# Altium schematic sheet ProgrammingInterface.SchDoc
size A4
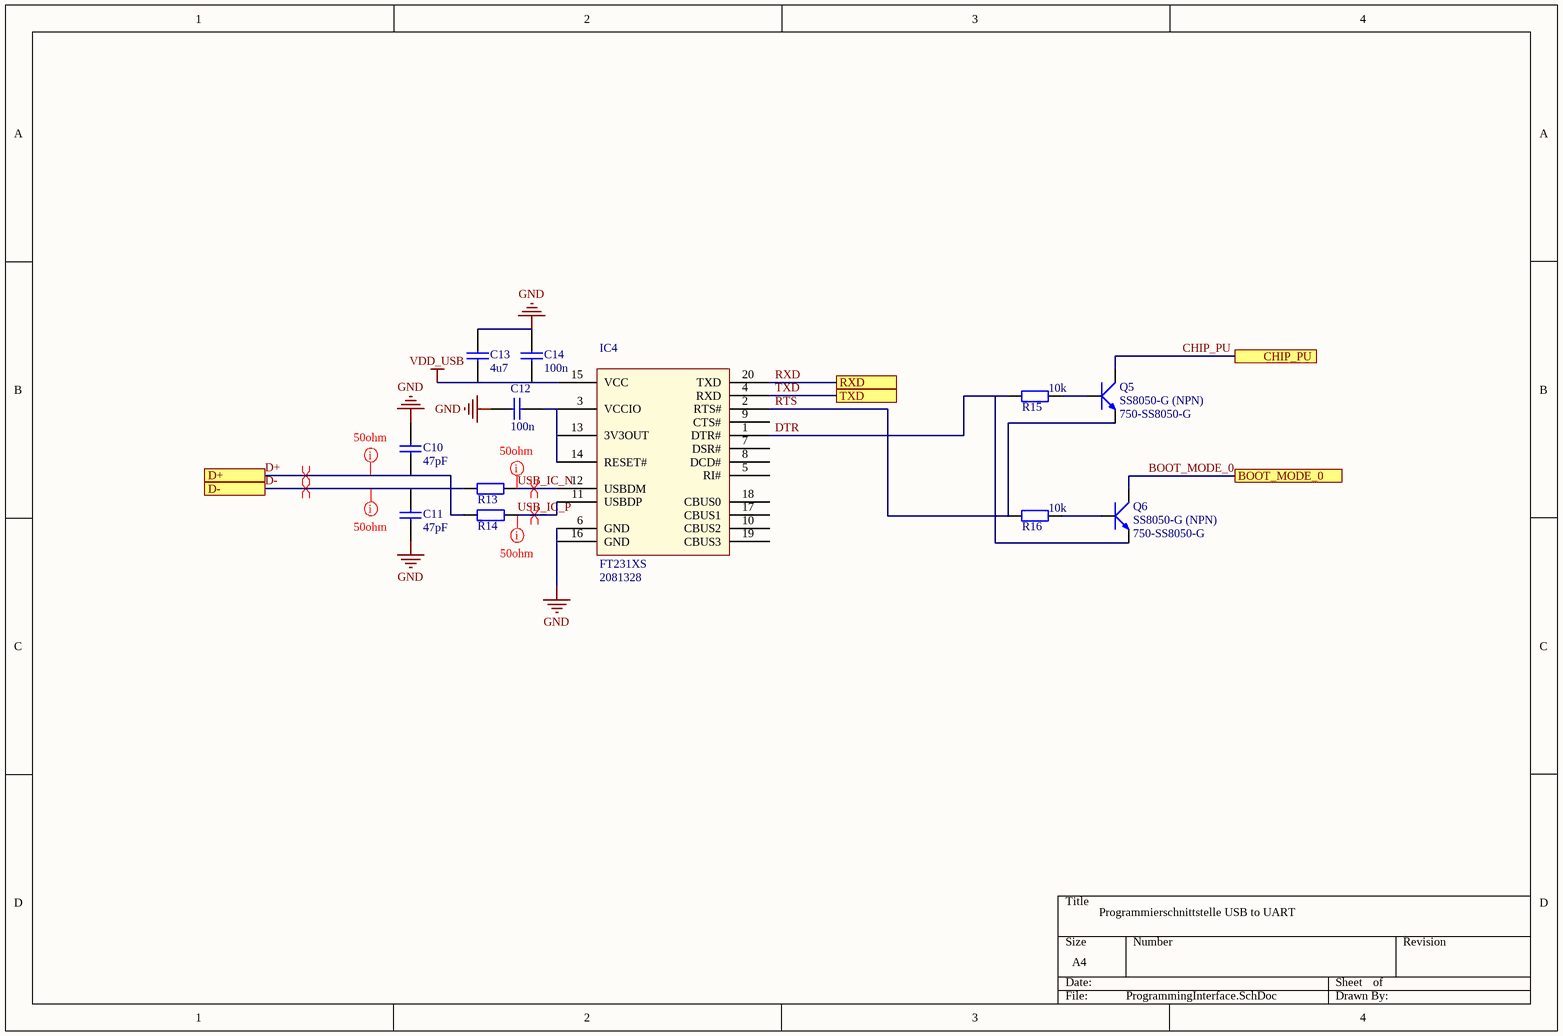
[diagram p0: ProgrammingInterface.SchDoc]

## Parts
C10  47pF  [CAPC1005X55]
C11  47pF  [CAPC1005X55]
C12  100n  [CAPC1005X55]
C13  4u7  [CAPC1005X55]
C14  100n  [CAPC1005X55]
IC4  FT231XS  Supplier Part Number 1: 2081328  [SOP65P600X175-20]
Q5  SS8050-G (NPN)  Supplier Part Number 1: 750-SS8050-G  [SS8050-G (NPN)]
Q6  SS8050-G (NPN)  Supplier Part Number 1: 750-SS8050-G  [SS8050-G (NPN)]
R13  (no value)  [RESC1005X40]
R14  (no value)  [RESC1005X40]
R15  10k  [RESC1005X40]
R16  10k  [RESC1005X40]

## Ports
BOOT_MODE_0, CHIP_PU, D+, D-, RXD, TXD

## Nets
GND: C10.2 C11.1 C12.1 C13.2 C14.2 IC4.6(GND) IC4.16(GND)
VDD_USB: C13.1 C14.1 IC4.15(VCC)
BOOT_MODE_0: Q6.3(Collector) ; port BOOT_MODE_0
CHIP_PU: Q5.3(Collector) ; port CHIP_PU
D+: C10.1 R14.1 ; port D+
D-: C11.2 R13.1 ; port D-
DTR: IC4.1(DTR#) Q6.2(Emitter) R15.1
RTS: IC4.2(RTS#) Q5.2(Emitter) R16.1
RXD: IC4.20(TXD) ; port RXD
TXD: IC4.4(RXD) ; port TXD
USB_IC_N: IC4.12(USBDM) R13.2
USB_IC_P: IC4.11(USBDP) R14.2
NetC12_2: C12.2 IC4.3(VCCIO) IC4.13(3V3OUT) IC4.14(RESET#)
NetQ5_1: Q5.1(Base) R15.2
NetQ6_1: Q6.1(Base) R16.2

Not connected (* = marked no-connect by the designer): IC4 5(RI#) 7(DSR#) 8(DCD#) 9(CTS#) 10(CBUS2) 17(CBUS1) 18(CBUS0) 19(CBUS3)

## Layout directives
differential pair: D+, D-, USB_IC_N, USB_IC_P
50ohm: Undefined: D+, D-, USB_IC_N, USB_IC_P

## Notes on the sheet
- Programmierschnittstelle USB to UART

## Library data of the parts
C10 C11 = 1076: Manufacturer ID: C0402C470J5GAC; Manufacturer: Kemet; ID: 1076; Type: Standard Ceramic; Value: 47p; Voltage: 50V; Dielectric: Ceramic; Characteristic: NP0; Tolerance: ±5%; UBiKS Number: UBiKS-C00011N; Footprint / Size: C0402; Farnell: 1414592; Unit Price: 0; Quantity: 0; ComponentLink1Description: Website; ComponentLink1URL: http://kemet.com/; ComponentLink2Description: Datasheet; ComponentLink2URL: http://www.kemet.com/kemet/web/homepage/kechome.nsf/vapubfiles/F3102_C0G.pdf/$file/F3102_C0G.pdf
C12 C14 = 1066: Manufacturer ID: C0402C104K4RAC; Manufacturer: Kemet; ID: 1066; Type: Standard Ceramic; Voltage: 16V; Dielectric: Ceramic; Characteristic: X7R; Tolerance: ±15%; UBiKS Number: UBiKS-C00001I; Value: 100n; Footprint / Size: C0402; Farnell: 1288252; Digikey: 399-3521-1-ND; Distributor 3: Mouser; Distributor Number 3: 80-C0402C104K4RAUTO; Unit Price: 0; Quantity: 0; ComponentLink1Description: Website; ComponentLink1URL: http://kemet.com/; ComponentLink2Description: Datasheet; ComponentLink2URL: http://www.kemet.com/kemet/web/homepage/kechome.nsf/vapubfiles/F3102_X7R.pdf/$file/F3102_X7R.pdf
C13 = 1253: Ceramic Chip Capacitor; Manufacturer ID: GRM155R60J475ME47D; Manufacturer: Murata; ID: 1253; Type: Standard Ceramic; Voltage: 6.3V; Characteristic: X5R; Tolerance: ±20%; UBiKS Number: UBiKS-C00140A; Value: 4u7; Dielectric: Ceramic; Footprint / Size: C0402; Farnell: 2426952; ComponentLink1Description: Website; ComponentLink1URL: http://www.murata.com/; ComponentLink2Description: Datasheet; ComponentLink2URL: http://www.farnell.com/datasheets/1769893.pdf
IC4 = 5331: USB to UART; Manufacturer: FTDI; ID: 5331; UBiKS Number: UBiKS-U00288M; Farnell: 2081328; Type: USB; Manufacturer ID: FT231XS; Pins: 20; Footprint / Size: SOP-20; Digikey: 768-1129-1-ND; Distributor Number 3: 895-FT231XS-R; ComponentLink1Description: Website; ComponentLink1URL: http://www.ftdichip.com/; ComponentLink2Description: Datasheet; ComponentLink2URL: http://www.ftdichip.com/Support/Documents/DataSheets/ICs/DS_FT231X.pdf; Supplier 1: Farnell
R13 R14 = 2282: Resistor; Manufacturer ID: MC 0.0625W 0402 1% 27R; Manufacturer: Multicomp; ID: 2282; Value: 27R; Element Type: Thick Film; Tolerance: ±1%; Power rating: 0.063W; Temperatur coeff: ±200ppm/°C; UBiKS Number: UBiKS-R00154S; Type: Standard; Footprint / Size: R0402; Farnell: 1358000; Unit Price: 0; Quantity: 0; ComponentLink1Description: Website; ComponentLink2Description: Datasheet; ComponentLink2URL: http://www.farnell.com/datasheets/318400.pdf
R15 R16 = 2123: Resistor; Manufacturer ID: MC 0.0625W 0402 1% 10K; Manufacturer: Multicomp; ID: 2123; Element Type: Thick Film; Tolerance: ±1%; Power rating: 0.063W; Temperatur coeff: ±100ppm/°C; UBiKS Number: UBiKS-R00007H; Type: Standard; Value: 10k; Footprint / Size: R0402; Farnell: 1358069; ComponentLink1Description: Website; ComponentLink2Description: Datasheet; ComponentLink2URL: http://www.farnell.com/datasheets/318400.pdf
Q5 Q6 = SS8050-G (NPN): Supplier 1: Mouser